# Altium schematic sheet LoRa_module_Top Level.SchDoc
size A4
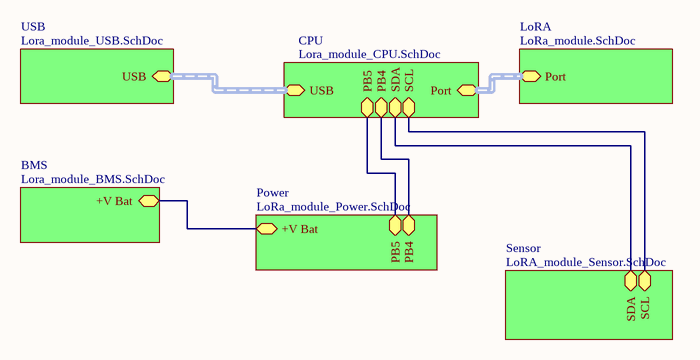
[diagram p0: LoRa_module_Top Level.SchDoc]

## Sub-sheets
BMS = Lora_module_BMS.SchDoc: +V Bat
CPU = Lora_module_CPU.SchDoc: PB4 (bidir), PB5, SDA, SCL, Port (harness Harness), USB (harness Harness)
LoRA = LoRa_module.SchDoc: Port (harness Harness)
Power = LoRa_module_Power.SchDoc: +V Bat, PB4, PB5
Sensor = LoRA_module_Sensor.SchDoc: SDA, SCL
USB = Lora_module_USB.SchDoc: USB (harness Harness)

## Nets
(unnamed): sheet Sensor/SDA, sheet CPU/SDA
(unnamed): sheet Sensor/SCL, sheet CPU/SCL
(unnamed): sheet CPU/PB4, sheet Power/PB4
(unnamed): sheet CPU/PB5, sheet Power/PB5
(unnamed): sheet BMS/+V Bat, sheet Power/+V Bat

## Buses and harness runs
harness sheet CPU/Port = sheet LoRA/Port
harness sheet CPU/USB = sheet USB/USB